# Altium schematic sheet eps_imu.SchDoc: Inertial Measurement Unit
size A; DrawnBy: Mohamed Hirole; Organization: UTAT SS; DocumentNumber: 8; Revision: 1.0; SheetNumber: 8; SheetTotal: 17
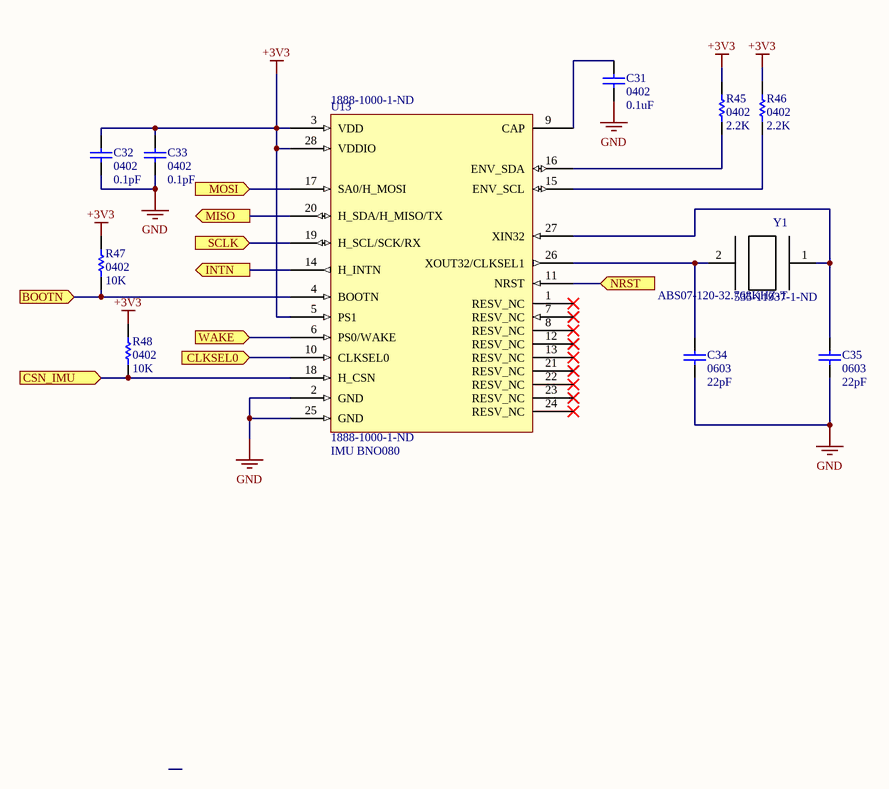
[diagram p0: eps_imu.SchDoc]

## Parts
C31  0402  value 0.1uF  [CAP0402R]
C32  0402  value 0.1pF  [CAP0402R]
C33  0402  value 0.1pF  [CAP0402R]
C34  0603  value 22pF  [CAP0603R]
C35  0603  value 22pF  [CAP0603R]
R45  0402  value 2.2K  [RES0402R]
R46  0402  value 2.2K  [RES0402R]
R47  0402  value 10K  [RES0402R]
R48  0402  value 10K  [RES0402R]
U13  IMU BNO080  [1888-1000-1-ND]
Y1  ABS07-120-32.768KHZ-T  Supplier Part Number 1: 535-11937-1-ND  [ABS07-120-32.768]

## Ports
BOOTN (in), CLKSEL0 (in), CSN_IMU (in), INTN (out), MISO (out), MOSI (in), NRST (in), SCLK (in), WAKE (in)

## Nets
+3V3: C32.2 C33.2 R45.2 R46.2 R47.2 R48.2 U13.3(VDD) U13.5(PS1) U13.28(VDDIO)
GND: C31.1 C32.1 C33.1 C34.1 C35.1 U13.2(GND) U13.25(GND)
BOOTN: R47.1 U13.4(BOOTN) ; port BOOTN
CLKSEL0: U13.10(CLKSEL0) ; port CLKSEL0
CSN_IMU: R48.1 U13.18(H_CSN) ; port CSN_IMU
INTN: U13.14(H_INTN) ; port INTN
MISO: U13.20(H_SDA/H_MISO/TX) ; port MISO
MOSI: U13.17(SA0/H_MOSI) ; port MOSI
NRST: U13.11(NRST) ; port NRST
SCLK: U13.19(H_SCL/SCK/RX) ; port SCLK
WAKE: U13.6(PS0/WAKE) ; port WAKE
NetC31_2: C31.2 U13.9(CAP)
NetC34_2: C34.2 U13.26(XOUT32/CLKSEL1) Y1.2
NetC35_2: C35.2 U13.27(XIN32) Y1.1
NetR45_1: R45.1 U13.16(ENV_SDA)
NetR46_1: R46.1 U13.15(ENV_SCL)

Not connected (* = marked no-connect by the designer): U13 1(RESV_NC)* 7(RESV_NC)* 8(RESV_NC)* 12(RESV_NC)* 13(RESV_NC)* 21(RESV_NC)* 22(RESV_NC)* 23(RESV_NC)* 24(RESV_NC)*

## Library data of the parts
C31-C33 = CAP0402: 0402 capacitor
C34 C35 = CAP0603: 0603 capacitor
R45-R48 = RES0402: 0402 resistor
U13 = IMU BNO080: ACCEL/GYRO/MAG I2C 32BIT; Manufacturer: Hillcrest Laboratories; Sensor Type: Accelerometer,Gyroscope,Magnetometer; Output Type: SPI,I2C; Supplier 1: Digi-Key; Manufacturer Part Number: BNO080; Stock 1: 10778; Pricing 1: 1=13.48, 5=11.826, 10=10.643, 25=9.46, 50=8.7506, 100=7.568, 500=7.095, 1000=6.622 (USD); Mount: Surface Mount; Case/Package: LGA; Min Operating Temperature: -40°C; Max Operating Temperature: 85°C; Packaging: Tape and Reel; Supplier Part Number 1: 1888-1000-1-ND
Y1 = ABS07-120-32.768KHZ-T: 3.2 x 1.5mm, 32.768KHZ Xtal 6pf, 20ppm, -40+85C, ESR 60kOhm, ST Micro Ref Design Crystal for STM32L; MF: Abracon; ESR (Equivalent Series Resistance): 55kR; Series Resistance: 60kR; MP: ABS07-120-32.768KHZ-T; SnapEDA_Link: https://www.snapeda.com/parts/ABS07-120-32.768KHZ-T/Abracon%20LLC/view-part/?ref=snap; Package: SMD-2 Abracon; Price: 0.37 USD; Availability: Good; Value: *; Supplier 1: Digi-Key; Manufacturer: Abracon; Manufacturer Part Number: ABS07-120-32.768KHZ-T; Stock 1: 213739; Pricing 1: 1=0.57, 10=0.473, 50=0.4258, 100=0.3784, 500=0.35948, 1000=0.30272 (USD); Mount: Surface Mount; Case/Package: SMD/SMT; Number of Pins: 2; Min Operating Temperature: -40°C; Max Operating Temperature: 85°C; Tolerance: 20ppm; Frequency: 32.768kHz; Load Capacitance: 6pF; Frequency Tolerance: 20ppm; Packaging: Tape and Reel; Package Quantity: 3000; Termination: SMD/SMT; Length: 3.2mm; Height: 0.035inch; Width: 0.061inch; Depth: 1.5mm; Radiation Hardening: No; REACH SVHC: No SVHC; Lead Free: Lead Free; ComponentLink1URL: https://www.verical.com/server-webapp/html/getDatasheet?partID=722402&src-supplier=Verical; ComponentLink1Description: https://www.verical.com/server-webapp/html/getDatasheet?partID=722402&src-supplier=Verical; ComponentLink2URL: https://abracon.com/Support/PackageDrawing/Resonators/ABS07-120.PDF?src-supplier=Digi-Key; ComponentLink2Description: https://abracon.com/Support/PackageDrawing/Resonators/ABS07-120.PDF?src-supplier=Digi-Key; ComponentLink3URL: http://www.mouser.com/ds/2/3/ABS07-120-32.768kHz-T-218607.pdf?src-supplier=Mouser; ComponentLink3Description: http://www.mouser.com/ds/2/3/ABS07-120-32.768kHz-T-218607.pdf?src-supplier=Mouser